# EAGLE design S14FullAmpV2 (EAGLE 9.6.2)
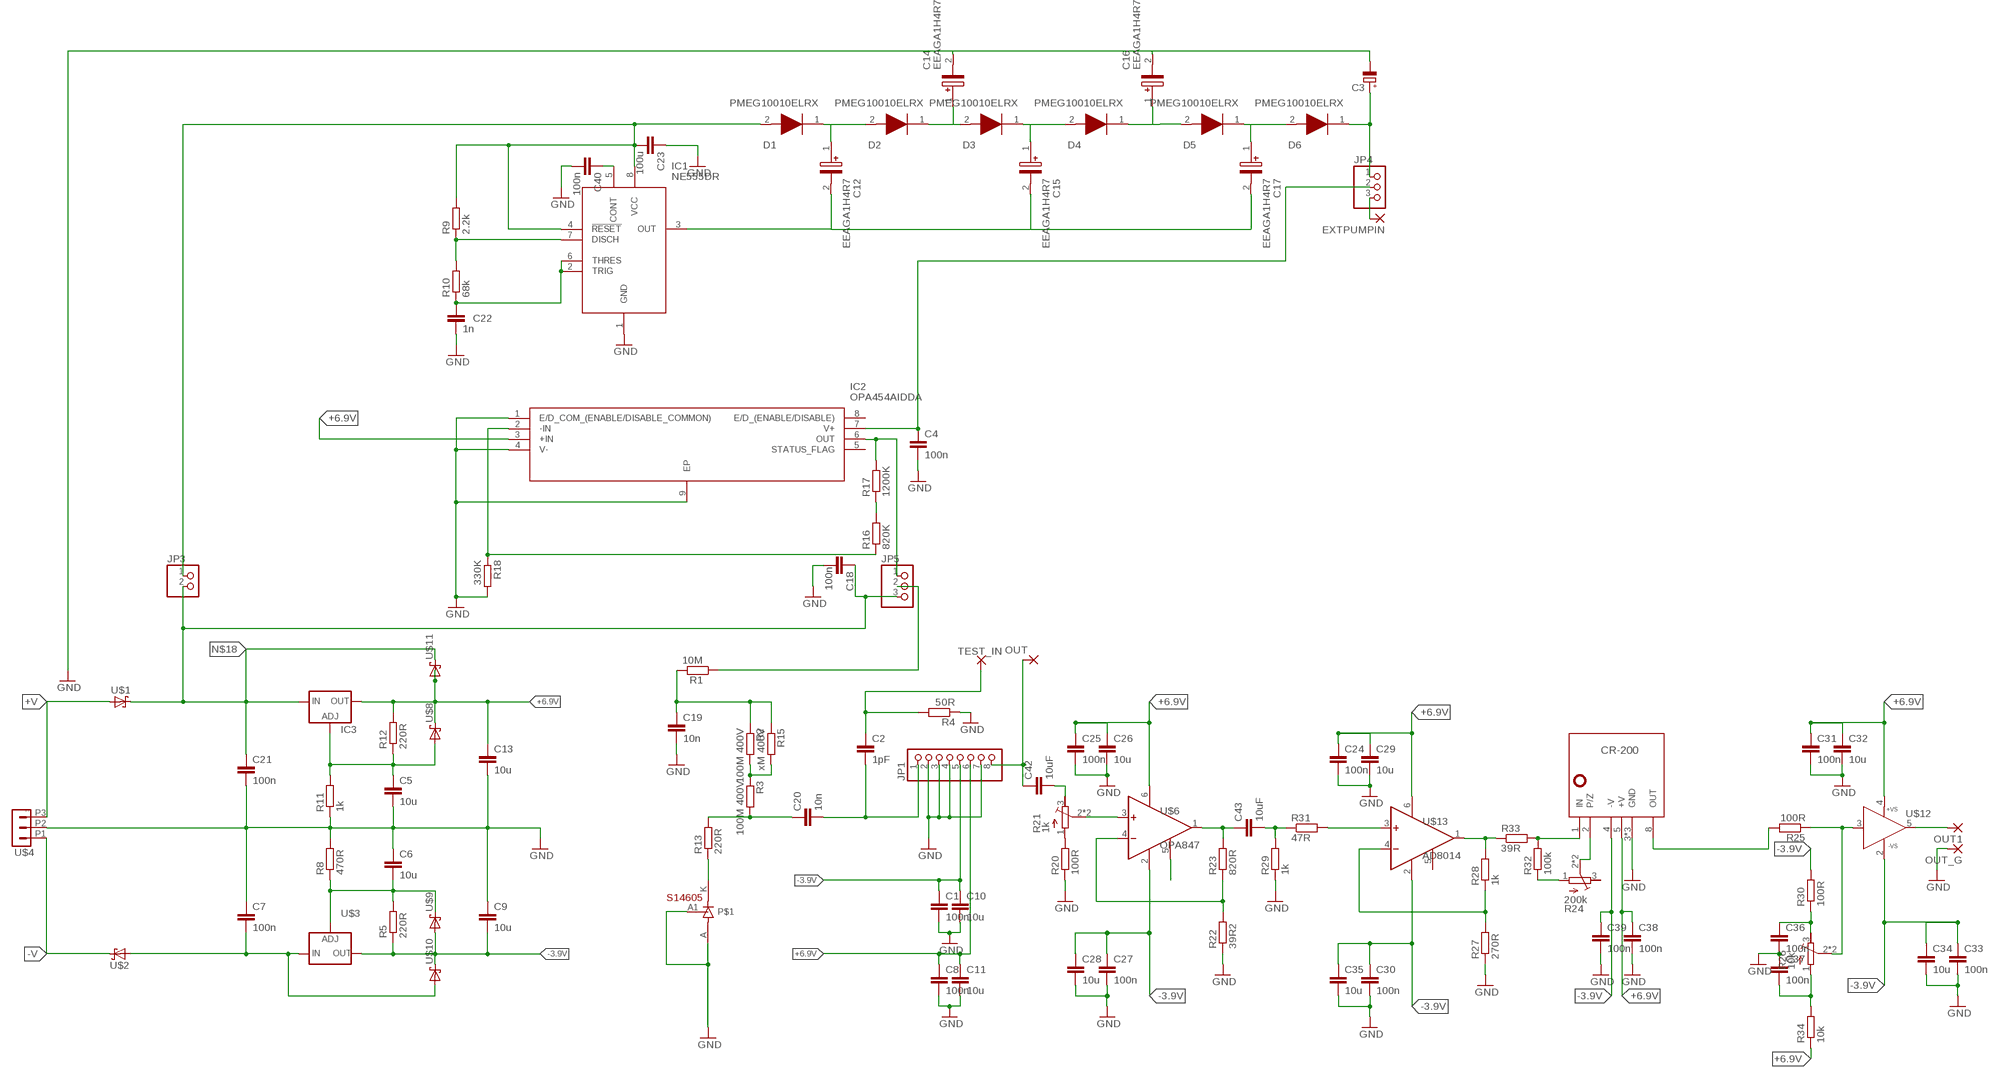
[diagram p0: schematic, sheet 1]

## Parts
C1  100n  C-EUC0603  [C0603]
C2  1pF  C-EUC0603  [C0603]
C3  CPOL-EUE3.5-8  [E3,5-8]
C4  100n  C-EUC0603  [C0603]
C5  10u  C-EUC0805  [C0805]
C6  10u  C-EUC0805  [C0805]
C7  100n  C-EUC0603  [C0603]
C8  100n  C-EUC0603  [C0603]
C9  10u  C-EUC0805  [C0805]
C10  10u  C-EUC0805  [C0805]
C11  10u  C-EUC0805  [C0805]
C12  EEAGA1H4R7  [CAPPRD150W50D400H800]
C13  10u  C-EUC0805  [C0805]
C14  EEAGA1H4R7  [CAPPRD150W50D400H800]
C15  EEAGA1H4R7  [CAPPRD150W50D400H800]
C16  EEAGA1H4R7  [CAPPRD150W50D400H800]
C17  EEAGA1H4R7  [CAPPRD150W50D400H800]
C18  100n  C-EUC0603  [C0603]
C19  10n  C-EUC0603  [C0603]
C20  10n  C-EUC0603  [C0603]
C21  100n  C-EUC0603  [C0603]
C22  1n  C-EUC0603  [C0603]
C23  100u  C-EUC0603  [C0603]
C24  100n  C-EUC0603  [C0603]
C25  100n  C-EUC0603  [C0603]
C26  10u  C-EUC0805  [C0805]
C27  100n  C-EUC0603  [C0603]
C28  10u  C-EUC0805  [C0805]
C29  10u  C-EUC0805  [C0805]
C30  100n  C-EUC0603  [C0603]
C31  100n  C-EUC0603  [C0603]
C32  10u  C-EUC0805  [C0805]
C33  100n  C-EUC0603  [C0603]
C34  10u  C-EUC0805  [C0805]
C35  10u  C-EUC0805  [C0805]
C36  100n  C-EUC0603  [C0603]
C37  100n  C-EUC0603  [C0603]
C38  100n  C-EUC0603  [C0603]
C39  100n  C-EUC0603  [C0603]
C40  100n  C-EUC0603  [C0603]
C42  10uF  C-EUC0805  [C0805]
C43  10uF  C-EUC0805  [C0805]
CR-200  CR-200H  [CR-XXX-H]
D1  PMEG10010ELRX  [SODFL3517X110N]
D2  PMEG10010ELRX  [SODFL3517X110N]
D3  PMEG10010ELRX  [SODFL3517X110N]
D4  PMEG10010ELRX  [SODFL3517X110N]
D5  PMEG10010ELRX  [SODFL3517X110N]
D6  PMEG10010ELRX  [SODFL3517X110N]
EXTPUMPIN  1,6/0,9  [1,6/0,9]
IC1  NE555DR  [SOIC127P600X175-8N]
IC2  OPA454AIDDA  [SOIC127P600X170-9N]
IC3  LM317  [SO-08]
JP1  HEADER-1X8ROUND  [1X08_ROUND]
JP3  PINHD-1X2  [1X02]
JP4  PINHD-1X3  [1X03]
JP5  PINHD-1X3  [1X03]
OUT  1,6/0,9  [1,6/0,9]
OUT1  2,54/0,9  [2,54/0,9]
OUT_G  2,54/0,9  [2,54/0,9]
R1  10M  R-EU_M0805  [M0805]
R2  100M 400V  R-EU_M1206  [M1206]
R3  100M 400V  R-EU_M1206  [M1206]
R4  50R  R-EU_R0805  [R0805]
R5  220R  R-EU_R0603  [R0603]
R8  470R  R-EU_R0603  [R0603]
R9  2.2k  R-EU_R0805  [R0805]
R10  68k  R-EU_R0805  [R0805]
R11  1k  R-EU_R0603  [R0603]
R12  220R  R-EU_R0603  [R0603]
R13  220R  R-EU_R0805  [R0805]
R15  xM 400V  R-EU_M1206  [M1206]
R16  820K  R-EU_R0805  [R0805]
R17  1200K  R-EU_R0805  [R0805]
R18  330K  R-EU_R0805  [R0805]
R20  100R  R-EU_R0603  [R0603]
R21  1k  R-TRIMM3299WS_UNI  [RTRIM3299W]
R22  39R2  R-EU_R0603  [R0603]
R23  820R  R-EU_R0603  [R0603]
R24  200k  R-TRIMM3299WS_UNI  [RTRIM3299W]
R25  100R  R-EU_R0603  [R0603]
R26  10k  R-TRIMM3299WS_UNI  [RTRIM3299W]
R27  270R  R-EU_R0603  [R0603]
R28  1k  R-EU_R0603  [R0603]
R29  1k  R-EU_R0603  [R0603]
R30  100R  R-EU_R0603  [R0603]
R31  47R  R-EU_R0603  [R0603]
R32  100k  R-EU_R0603  [R0603]
R33  39R  R-EU_R0603  [R0603]
R34  10k  R-EU_R0603  [R0603]
S1  S14605  [RHDR3W53P0X254_1X3_762X246X425]
TEST_IN  1,6/0,9  [1,6/0,9]
U$1  BAS383  [MICROMELF-R]
U$2  BAS383  [MICROMELF-R]
U$3  LM337-SO8  [SO8]
U$4  XHT03T  [XHT03]
U$6  OPA847  [SOT23-6]
U$8  BAS383  [MICROMELF-R]
U$9  BAS383  [MICROMELF-R]
U$10  BAS383  [MICROMELF-R]
U$11  BAS383  [MICROMELF-R]
U$12  MAX4201  [SOT23-5]
U$13  AD8014  OPA847  [SOT23-6]

## Nets
+6.9V: C8.1 C11.1 C13.1 C24.1 C25.1 C26.1 C29.1 C31.1 C32.1 C38.1 CR-200.5(+V) IC2.3(+IN) IC3.2(OUT) IC3.3(OUT) IC3.6(OUT) IC3.7(OUT) JP1.6 R12.2 R34.1 U$6.6(V+) U$8.C U$11.A U$12.4(+VS) U$13.6(V+)
+V: U$1.A U$4.P3
-3.9V: C1.1 C9.2 C10.1 C27.1 C28.1 C30.1 C33.1 C34.1 C35.1 C39.1 CR-200.4(-V) JP1.5 R5.1 R30.2 U$3.1(OUT) U$6.2(V-) U$9.A U$10.C U$12.2(-VS) U$13.2(V-)
-V: U$2.C U$4.P1
GND: C1.2 C3.- C4.2 C5.2 C6.1 C7.1 C8.2 C9.1 C10.2 C11.2 C13.2 C14.2(-) C16.2(-) C18.2 C19.2 C21.2 C22.2 C23.1 C24.2 C25.2 C26.2 C27.2 C28.2 C29.2 C30.2 C31.2 C32.2 C33.2 C34.2 C35.2 C36.2 C37.1 C38.2 C39.2 C40.2 CR-200.3(GND) CR-200.6(GND) CR-200.7(GND) IC1.1(GND) IC2.1(E/D_COM_(ENABLE/DISABLE_COMMON)) IC2.4(V-) IC2.9(EP) JP1.2 JP1.3 JP1.4 JP1.7 OUT_G.1(P) R4.1 R8.2 R11.1 R18.2 R20.1 R22.1 R27.1 R29.1 S1.A1 S1.A(ANODE) U$4.P2
N$1: C19.1 R1.2 R2.1 R15.1
N$2: JP5.2 R1.1
N$3: R2.2 R3.1 R15.2
N$4: C20.1 R3.2 R13.2
N$5: C2.2 C20.2 JP1.1
N$6: C2.1 R4.2 TEST_IN.1(P)
N$7: C42.1 JP1.8 OUT.1(P)
N$8: R24.1(A) R32.1
N$9: EXTPUMPIN.1(P) JP4.3
N$10: C23.2 D1.2(A) IC1.4(!RESET) IC1.8(VCC) JP3.1 R9.2
N$12: C6.2 R5.2 R8.1 U$3.4(ADJ) U$9.C
N$13: R13.1 S1.K(KATHODE)
N$14: C5.1 IC3.4(ADJ) R11.2 R12.1 U$8.A
N$15: R16.2 R17.1
N$16: C12.1(+) D1.1(K) D2.2(A)
N$17: C12.2(-) C15.2(-) C17.2(-) IC1.3(OUT)
N$18: C18.1 C21.1 IC3.1(IN) JP3.2 JP5.3 U$1.C U$11.C
N$19: C14.1(+) D2.1(K) D3.2(A)
N$20: C40.1 IC1.5(CONT)
N$21: C3.+ D6.1(K) JP4.1
N$22: C15.1(+) D3.1(K) D4.2(A)
N$23: C16.1(+) D4.1(K) D5.2(A)
N$24: R20.2 R21.1(A)
N$25: C17.1(+) D5.1(K) D6.2(A)
N$26: C42.2 R21.3(E)
N$27: IC1.7(DISCH) R9.1 R10.2
N$28: C22.1 IC1.2(TRIG) IC1.6(THRES) R10.1
N$29: IC2.6(OUT) JP5.1 R17.2
N$30: IC2.2(-IN) R16.1 R18.1
N$31: R22.2 R23.1 U$6.4(-IN)
N$32: R21.2(S) R21.4(S) U$6.3(+IN)
N$35: R25.1 R26.2(S) R26.4(S) U$12.3(IN)
N$36: OUT1.1(P) U$12.5(OUT)
N$37: R27.2 R28.1 U$13.4(-IN)
N$38: CR-200.1(IN) R32.2 R33.2
N$39: R31.2 U$13.3(+IN)
N$40: U$6.5(SH)
N$41: C36.1 R26.3(E) R30.1
N$42: CR-200.2(P/Z) R24.2(S) R24.4(S)
N$43: C43.1 R23.2 U$6.1(OUT)
N$44: C43.2 R29.2 R31.1
N$45: C4.1 IC2.7(V+) JP4.2
N$46: R28.2 R33.1 U$13.1(OUT)
N$47: C37.2 R26.1(A) R34.2
N$48: CR-200.8(OUT) R25.2
V-: C7.2 U$2.A U$3.2(IN) U$3.3(IN) U$3.6(IN) U$3.7(IN) U$10.A
Unconnected: IC2.5(STATUS_FLAG) IC2.8(E/D_(ENABLE/DISABLE)) R24.3(E)

## Power pins joined to a net without a drawn wire
SH: U$13.5(SH)

## Library data of the parts
C1 C4 C8 C10 C11 C19 C20 C22 C26 C28 C29 C32 C34 C35 C42 C43 = resistor:C-EU: CAPACITOR, European symbol
C2 C5-C7 C9 C13 C18 C21 C23-C25 C27 C30 C31 C33 C36-C40 = rcl:C-EU: CAPACITOR, European symbol
C3 = rcl:CPOL-EU: POLARIZED CAPACITOR, European symbol
C12 C14-C17 = EEAGA1H4R7:EEAGA1H4R7: Panasonic 4.7F 50V dc Aluminium Electrolytic Capacitor, Through Hole 4 (Dia.) x 7mm +105C 4mm 1.5mm Source: Datasheet <http://industrial.panasonic.com/cdbs/www-data/pdf/RDF0000/ABA0000C1041.pdf>; DESCRIPTION: Panasonic 4.7F 50V dc Aluminium Electrolytic Capacitor, Through Hole 4 (Dia.) x 7mm +105C 4mm 1.5mm; HEIGHT: 8mm; MANUFACTURER_NAME: Panasonic; MANUFACTURER_PART_NUMBER: EEAGA1H4R7
CR-200 = cremat:CR-200
D1-D6 = PMEG10010ELRX:PMEG10010ELRX: Diode Schottky 100V 1A Surface Mount CFP3 Source: Datasheet <https://assets.nexperia.com/documents/data-sheet/PMEG10010ELR.pdf>; DESCRIPTION: Diode Schottky 100V 1A Surface Mount CFP3; HEIGHT: 1.1mm; MANUFACTURER_NAME: Nexperia; MANUFACTURER_PART_NUMBER: PMEG10010ELRX; MOUSER_PART_NUMBER: 771-PMEG10010ELRX; MOUSER_PRICE-STOCK: https://www.mouser.co.uk/ProductDetail/Nexperia/PMEG10010ELRX?qs=bel5lzaZNxTBP7lsf64PhA%3D%3D
EXTPUMPIN OUT TEST_IN = wirepad:1,6/0,9: THROUGH-HOLE PAD
IC1 = NE555DR:NE555DR: Single Precision Timer Source: Datasheet <https://www.ti.com/lit/gpn/ne555>; DESCRIPTION: Single Precision Timer; HEIGHT: 1.75mm; MANUFACTURER_NAME: Texas Instruments; MANUFACTURER_PART_NUMBER: NE555DR
IC2 = OPA454AIDDA:OPA454AIDDA: High Voltage (100V), High-Current (50mA) Operational Amplifiers, G=1 Stable Source: Datasheet <http://componentsearchengine.com/Datasheets/3/OPA454AIDDA.pdf>; DESCRIPTION: High Voltage (100V), High-Current (50mA) Operational Amplifiers, G=1 Stable; HEIGHT: 1.7mm; MANUFACTURER_NAME: Texas Instruments; MANUFACTURER_PART_NUMBER: OPA454AIDDA
IC3 = v-reg:LM317?*: 500 mA Adjustable Output Positive Voltage Regulator Source: http://www.onsemi.co.jp .. LM317M-D.PDF
JP1 = microbuilder:HEADER-1X8: PIN HEADER
JP3 = pinhead:PINHD-1X2: PIN HEADER
JP4 JP5 = pinhead:PINHD-1X3: PIN HEADER
OUT1 OUT_G = wirepad:2,54/0,9: THROUGH-HOLE PAD
R1 R4 R5 R8-R13 R16-R18 R20 R22 R23 R25 R27-R34 = rcl:R-EU_: RESISTOR, European symbol
R2 R3 R15 = resistor:R-EU_: RESISTOR, European symbol
R21 R24 R26 = rcl:R-TRIMM: Trimm resistor
S1 = S14:S14605
U$1 U$2 U$8-U$11 = diode:BAS383
U$3 = v-reg:LM337-SO8
U$4 = Connectors:XHT03
U$6 U$13 = texas:OPA847
U$12 = analog-devices:MAX4201

## Board
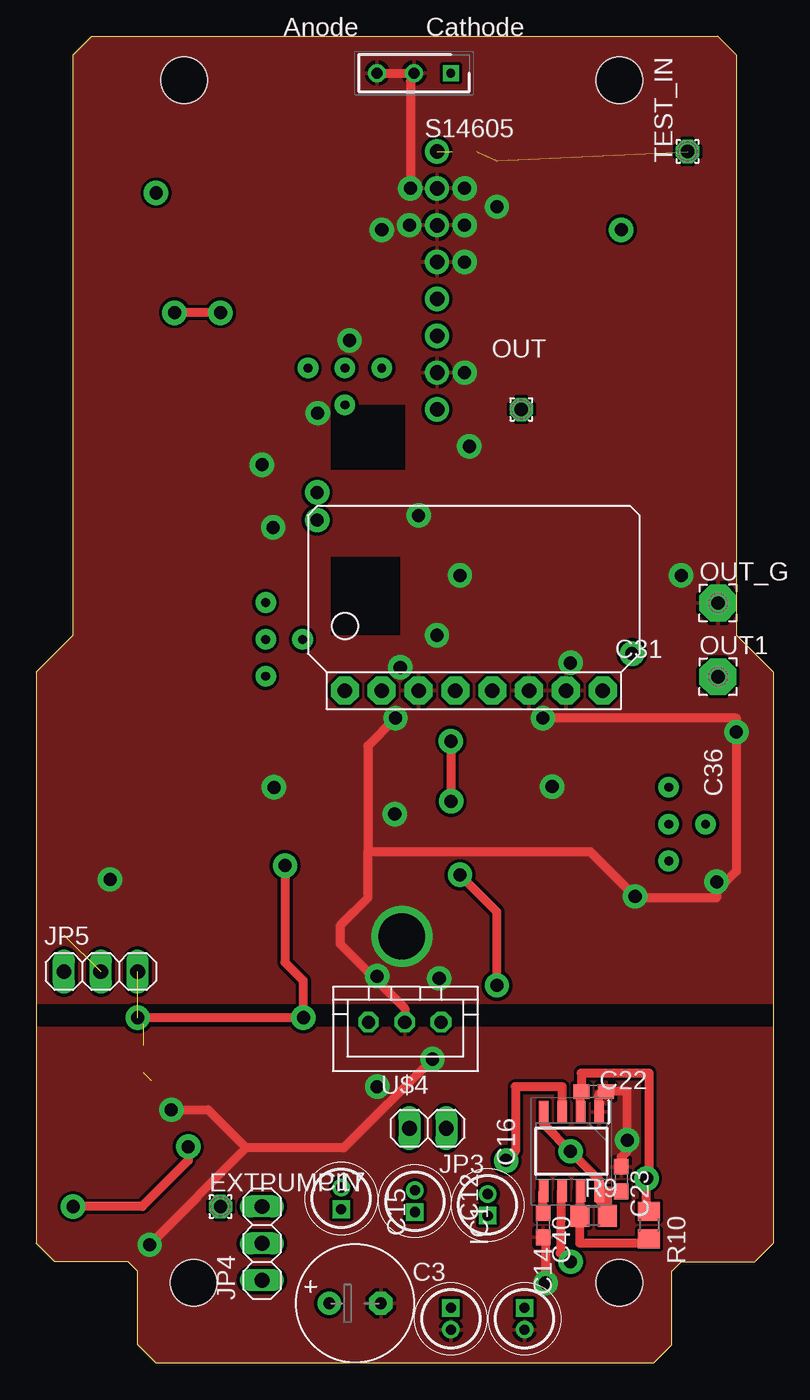
[diagram p1: board, top side]
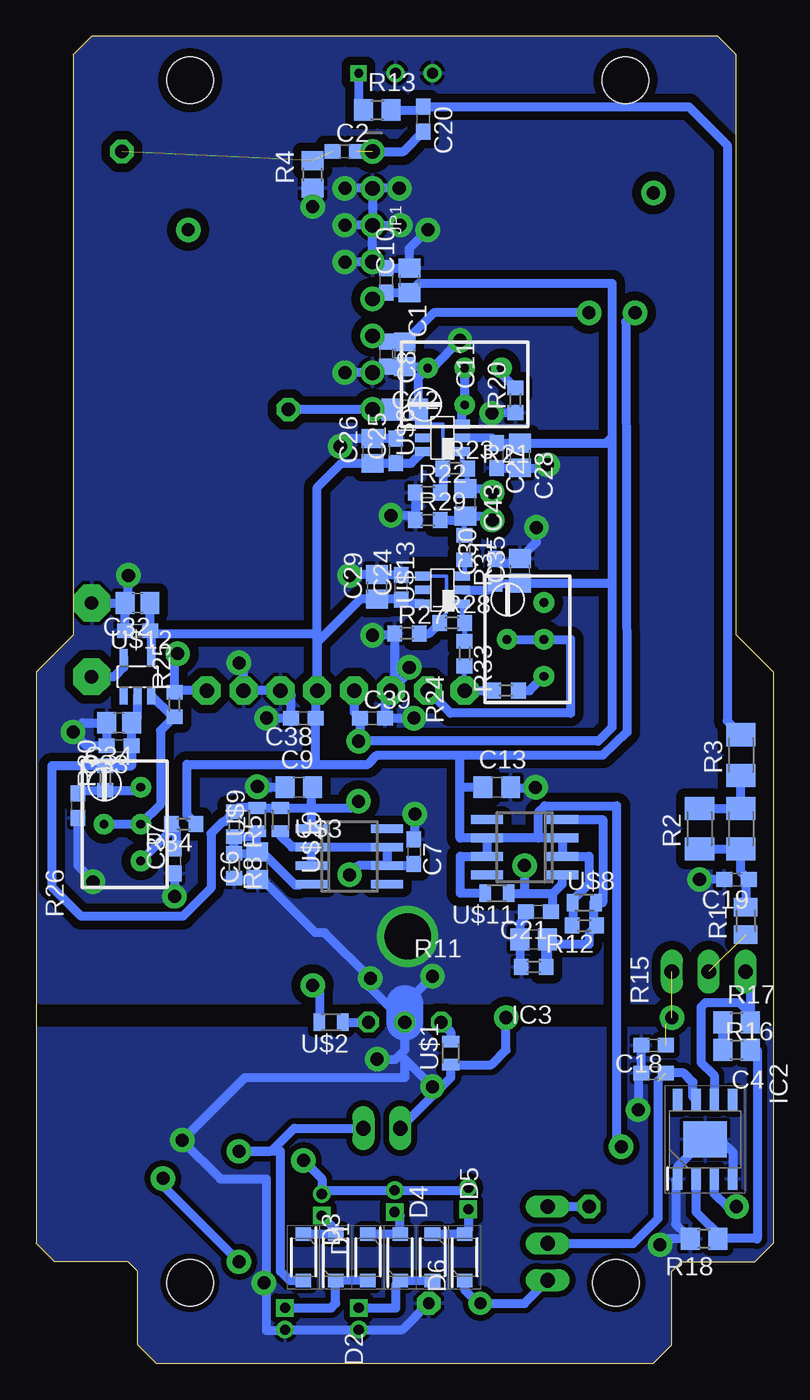
[diagram p2: board, bottom side, seen from below]

Size 50.8 x 91.44 mm. Coordinates in mm from the lower left corner, seen from the top.
Outline: 50.8,20.96 arc0 50.8,20.96
Outline: 3.81,91.44 46.99,91.44 48.26,90.17 48.26,50.16 50.8,47.62 50.8,8.25 49.53,6.98 44.45,6.98 43.81,6.35 43.81,1.27 42.55,0 8.26,0 6.99,1.27 6.99,6.35 6.35,6.98 1.27,6.98 0,8.25 0,47.62 2.54,50.16 2.54,90.17 3.81,91.44
Copper layers (1*16): Top 0.035mm / dielectric 1.5mm / Bottom 0.035mm
Design rules "default *": minimum track width 6mil, minimum drill 0.35mm, track to track 9mil, track to pad 9mil, pad to pad 9mil, via to via 9mil, smd to smd 6mil, copper to edge 0mil, drill to drill 6mil, minimum pad ring 10mil, minimum via ring 8mil, stop-mask expansion 4mil, vias tented up to drill 0mil, thermal gap 10mil
Holes 3.2 mm at 40.2,88.41 40.2,5.54 10.21,88.41 10.84,5.54

### Footprints (pad centres in the part's own frame; a part is rotated, then mirrored left to right if it is on the bottom)
C0603 = smd 1.1 x 1: 1 -0.85,0; 2 0.85,0
E3,5-8 = drill 0.813 pad 1.6: + -1.778,0 | drill 0.813 pad 1.6 octagon: - 1.778,0
C0805 = smd 1.3 x 1.5: 1 -0.95,0; 2 0.95,0
C0805' = smd 1.3 x 1.5: 1 -0.85,0; 2 0.85,0
CAPPRD150W50D400H800 = drill 0.7 pad 1.1 square: 1 0,0 | drill 0.7 pad 1.1: 2 1.5,0
CR-XXX-H = drill 1 pad 1.93 octagon: 1 -8.89,0; 2 -6.35,0; 3 -3.81,0; 4 -1.27,0; 5 1.27,0; 6 3.81,0; 7 6.35,0; 8 8.89,0
SODFL3517X110N = smd 0.92 x 1.08: 1 -1.6,0; 2 1.6,0
1,6/0,9 = drill 0.914 pad 1.6 octagon: 1 0,0
SOIC127P600X175-8N = smd 1.528 x 0.65: 1 -2.711,1.905; 2 -2.711,0.635; 3 -2.711,-0.635; 4 -2.711,-1.905; 5 2.711,-1.905; 6 2.711,-0.635; 7 2.711,0.635; 8 2.711,1.905
SOIC127P600X170-9N = smd 1.525 x 0.65: 1 -2.712,1.905; 2 -2.712,0.635; 3 -2.712,-0.635; 4 -2.712,-1.905; 5 2.712,-1.905; 6 2.712,-0.635; 7 2.712,0.635; 8 2.712,1.905 | smd 2.49 x 3: 9 0,0
SO-08 = smd 0.6 x 2.2: 1 -1.905,-2.6; 2 -0.635,-2.6; 3 0.635,-2.6; 4 1.905,-2.6; 5 1.905,2.6; 6 0.635,2.6; 7 -0.635,2.6; 8 -1.905,2.6
1X08_ROUND = drill 1 pad 1.676: 1 -8.89,0; 2 -6.35,0; 3 -3.81,0; 4 -1.27,0; 5 1.27,0; 6 3.81,0; 7 6.35,0; 8 8.89,0
1X02 = drill 1.016 long: 1 -1.27,0; 2 1.27,0
1X03 = drill 1.016 long: 1 -2.54,0; 2 0,0; 3 2.54,0
2,54/0,9 = drill 0.914 pad 2.54 octagon: 1 0,0
M0805 = smd 1.3 x 1.6: 1 -0.95,0; 2 0.95,0
M1206 = smd 1.6 x 2: 1 -1.4,0; 2 1.4,0
R0805 = smd 1.3 x 1.5: 1 -0.95,0; 2 0.95,0
R0603 = smd 1 x 1.1: 1 -0.85,0; 2 0.85,0
RTRIM3299W = drill 0.61 pad 1.422: 1 1.27,-2.54; 2 1.27,0; 3 1.27,2.54; 4 -1.27,0
RHDR3W53P0X254_1X3_762X246X425 = drill 0.75 pad 1.15: A 8.89,3.81; A1 6.35,3.81 | drill 0.6 square: K 3.81,3.81
MICROMELF-R = smd 0.8 x 1.2: A 0.8,0; C -0.8,0
SO8 = smd 0.6 x 2.2: 1 -1.905,-2.6; 2 -0.635,-2.6; 3 0.635,-2.6; 4 1.905,-2.6; 5 1.905,2.6; 6 0.635,2.6; 7 -0.635,2.6; 8 -1.905,2.6
XHT03 = drill 0.9 pad 1.422 octagon: P1 -2.5,0 | drill 0.9 octagon: P2 0,0; P3 2.5,0
SOT23-6 = smd 0.6 x 1.1: 1 -1,-1.4; 2 -0.05,-1.4; 3 0.9,-1.4; 4 0.9,1.3; 5 -0.05,1.3; 6 -1,1.3
SOT23-5 = smd 0.55 x 1.2: 1 -0.95,-1.3; 2 0,-1.3; 3 0.95,-1.3; 4 0.95,1.3; 5 -0.95,1.3

### Placement (x,y rotation side)
C1  26.67,74.61 90 bottom
C2  29.53,83.5 0 bottom
C3  21.97,4.13 0 top
C4  8.26,20 180 bottom
C5  16.51,29.21 180 bottom
C6  35.56,34.29 90 bottom
C7  24.77,35.24 270 bottom
C8  26.67,69.53 270 bottom
C9  32.7,39.69 0 bottom
C10  10u  [C0805']  25.08,74.61 90 bottom
C11  10u  [C0805']  25.4,69.53 270 bottom
C12  31.11,10.16 90 top
C13  19.05,39.69 0 bottom
C14  33.66,3.81 270 top
C15  26.1,10.41 90 top
C16  28.57,3.81 270 top
C17  21.02,10.6 90 top
C18  8.26,21.91 180 bottom
C19  2.54,33.34 180 bottom
C20  24.13,85.72 270 bottom
C21  16.19,31.11 180 bottom
C22  38.42,18.73 0 top
C23  40.32,12.7 270 top
C24  25.65,53.47 90 bottom
C25  26.03,62.86 90 bottom
C26  10u  [C0805']  27.62,62.86 90 bottom
C27  19.05,62.55 270 bottom
C28  10u  [C0805']  17.46,62.55 270 bottom
C29  10u  [C0805']  27.3,53.5 90 bottom
C30  19.18,54.58 90 bottom
C31  43.81,50.48 180 bottom
C32  10u  [C0805']  43.81,52.39 180 bottom
C33  45.09,42.55 180 bottom
C34  10u  [C0805']  45.09,44.13 180 bottom
C35  10u  [C0805']  17.46,54.61 90 bottom
C36  47.94,38.42 270 bottom
C37  41.27,34.61 90 bottom
C38  32.38,44.45 180 bottom
C39  27.62,44.45 0 bottom
C40  34.92,9.52 270 top
C42  25.4,65.72 0 bottom
C43  21.22,59.32 270 bottom
CR-200  30.16,46.35 0 top
D1  32.38,7.3 270 bottom
D2  30.16,7.3 90 bottom
D3  27.94,7.3 270 bottom
D4  25.72,7.3 90 bottom
D5  23.49,7.3 270 bottom
D6  21.27,7.3 90 bottom
EXTPUMPIN  12.7,10.79 0 top
IC1  36.88,14.61 270 top
IC2  4.7,15.43 90 bottom
IC3  17.15,35.56 90 bottom
JP1  27.62,74.61 270 bottom
JP3  26.99,16.19 180 top
JP4  15.56,8.25 90 top
JP5  4.45,26.99 0 top
OUT  33.43,65.72 0 top
OUT1  46.99,47.31 0 top
OUT_G  46.99,52.39 0 top
R1  1.9,30.48 90 bottom
R2  5.08,36.83 90 bottom
R3  2.22,41.91 90 bottom
R4  31.75,81.91 90 bottom
R5  37.15,37.15 270 bottom
R8  37.15,34.29 270 bottom
R9  38.42,10.16 0 top
R10  42.23,9.52 270 top
R11  16.51,27.31 0 bottom
R12  13.02,30.16 180 bottom
R13  27.3,86.36 0 bottom
R15  2.22,36.83 90 bottom
R16  2.54,21.59 180 bottom
R17  2.54,23.5 0 bottom
R18  4.76,8.57 180 bottom
R20  17.78,66.36 90 bottom
R21  21.27,67.31 90 bottom
R22  23.81,60.01 0 bottom
R23  21.92,61.66 0 bottom
R24  17.08,49.88 0 bottom
R25  41.27,45.4 90 bottom
R26  44.86,37.15 0 bottom
R27  25.24,50.29 0 bottom
R28  22.13,51.02 0 bottom
R29  23.81,58.1 0 bottom
R30  46.04,40.32 90 bottom
R31  21.27,56.2 270 bottom
R32  18.41,46.35 180 bottom
R33  21.27,48.89 270 bottom
R34  40.64,37.15 180 bottom
S1  32.38,92.71 180 top
TEST_IN  44.89,83.5 90 top
U$1  22.23,21.37 90 bottom
U$2  30.48,23.5 180 bottom
U$3  29.21,34.92 270 bottom
U$4  25.4,23.5 180 top
U$6  22.86,63.82 90 bottom
U$8  13.02,31.75 0 bottom
U$9  35.56,37.47 90 bottom
U$10  33.97,37.47 270 bottom
U$11  19.05,32.39 180 bottom
U$12  43.81,47.31 0 bottom
U$13  22.86,53.34 90 bottom

### Tracks (layer width: path | path; a pad name or v marks a point on that pad's centre or on a via)
+6.9V  (via drill 0.9 pad 1.68)
  Top 0.61: v10.48,14.92 10.48,13.97 7.3,10.79 v2.54,10.79 | v12.7,72.39 v9.53,72.39
  Bottom 0.61: IC3.6 IC3.7 21.59,34.92 21.59,32.39 U$11.A | 16.19,36.19 IC3.3 IC3.2 12.7,34.92 12.7,33.03 13.82,31.91 U$8.C 13.82,30.21 R12.2 | 16.19,36.19 IC3.6 | IC3.6 21.59,36.19 21.59,39.69 | C31.1 42.86,50.38 U$12.4 | C31.1 C32.1 | R34.1 40.42,37.78 40.42,41.28 31.53,41.28 | 21.59,39.69 21.59,41.91 | CR-200.5 31.53,46.25 C38.1 31.53,41.28 | U$6.6 24.96,62.02 C25.1 C26.1 29.74,62.02 31.43,60.33 31.43,49.66 | 16.19,36.19 16.18,36.21 16.18,37.99 15.75,38.42 10.79,38.42 10.79,15.24 v10.48,14.92 | v2.54,10.79 3.18,10.79 4.06,11.68 IC2.3 | U$13.6 25.38,52.34 C24.1 25.69,52.65 C29.1 28.44,52.65 31.43,49.66 | CR-200.5 31.43,49.66 | C31.1 42.75,50.27 31.64,50.27 31.43,50.06 CR-200.5 | v9.53,72.39 10.16,71.75 10.08,43.5 11.75,41.91 21.59,41.91 | 31.53,41.28 27.94,41.28 27.3,41.91 21.59,41.91 | C13.1 21.59,39.69 | JP1.6 27.2,70.38 C8.1 C11.1 23.39,72.39 v12.7,72.39
+V
  Bottom 0.61: U$4.P3 22.23,22.82 U$1.A
-3.9V  (via drill 0.9 pad 1.68)
  Top 0.61: v28.57,42.86 28.59,42.84 v28.59,38.72
  Bottom 0.61: 32.07,38.27 U$10.C U$9.A 35.61,38.31 36.83,38.31 R5.1 37.81,37.33 37.92,37.33 38.76,36.49 38.76,32.75 40.71,30.8 47.69,30.8 49.72,32.83 49.72,41.17 R30.2 44.23,41.17 C33.1 C34.1 43.81,44.55 U$12.2 | 32.07,38.27 31.81,38.01 | U$3.1 31.81,38.01 | 32.07,38.27 29.05,38.27 v28.59,38.72 | CR-200.4 28.89,44.87 C39.1 28.47,42.86 v28.57,42.86 12.06,42.86 11.11,43.81 11.11,53.97 | 11.11,63.82 11.11,74.42 24.42,74.42 C10.1 C1.1 27.09,73.34 JP1.5 | 11.11,63.82 11.11,53.97 | U$6.2 19.42,63.77 C27.1 C28.1 11.53,63.4 11.11,63.82 | U$13.2 19.62,53.29 C30.1 17.49,53.73 C35.1 11.33,53.76 11.11,53.97 | 31.81,38.01 31.81,39.63 C9.2
-V
  Bottom 0.61: U$2.C U$4.P1
GND  (via drill 0.9 pad 1.68, 3.2)
  Top 0.61: C23.1 40.32,14.19 40.73,14.61 v40.73,15.37 40.73,18.73 C22.2 | S1.A S1.A1 26.03,88.58 25.78,88.33 v25.78,80.96 | v27.3,20.96 21.18,14.83 14.48,14.83 | 14.48,14.83 v7.81,8.16 8.1,8.45 | v34.92,44.45 48.26,44.45 v48.26,43.5 48.26,33.91 47.37,33.02 47.05,33.02 v46.89,33.18 46.89,32.07 41.38,32.07 v41.27,32.17 38.2,35.24 22.86,35.24 | U$4.P2 25.4,24.45 20.95,28.89 20.95,30.16 22.86,32.07 22.86,35.24 | v24.77,44.45 22.86,42.55 22.86,35.24 | IC1.1 38.79,18.55 | C40.2 35.11,8.49 v35.11,5.53 | v9.31,17.46 11.84,17.46 14.48,14.83
  Bottom 0.61: 34.92,5.71 34.92,2.25 33.71,2.25 | 34.92,5.71 34.92,12.7 38.1,12.7 40.73,15.33 v40.73,15.37 36.42,19.68 25.4,19.68 25.4,20.96 v23.49,19.05 | R11.1 17.46,27.31 C5.2 17.46,30.32 17.04,30.8 C21.2 | 32.07,79.38 v31.75,79.69 | 25.4,24.76 v23.49,26.67 | v27.3,20.96 26.03,20.96 25.4,21.59 U$4.P2 28.1,26.19 v27.77,26.52 30.92,29.66 31.56,29.66 35.24,33.34 C6.1 37.05,33.34 R8.2 | OUT_G.1 C32.2 | C31.2 C32.2 | C32.2 44.45,52.6 v44.45,54.29 | CR-200.3 26.77,45.94 C39.2 v24.77,44.45 | v34.92,44.45 C38.2 33.23,46.04 33.55,46.35 CR-200.6 CR-200.7 36.51,47.94 v36.83,48.26 | v46.89,33.18 46.89,33.24 47.94,34.29 C36.2 | C37.1 v41.27,32.17 | v7.81,8.16 7.81,8.38 7.62,8.57 R18.2 6.73,9.59 6.73,12.59 IC2.1 6.6,13.53 IC2.9 3.68,15.43 2.76,14.51 2.76,12.75 IC2.4 | v35.11,5.53 34.92,5.71 | JP1.2 JP1.3 | JP1.4 JP1.3 | v25.78,80.96 JP1.2 | v19.4,65.47 19.36,65.51 R20.1 | v9.31,17.46 9.31,19.8 C4.2 C18.2 | v23.81,78.1 25.08,76.83 C10.2 C1.2 27.09,75.88 JP1.4 | v21.59,70.48 23.39,68.68 C11.2 C8.2 27.2,68.68 JP1.7 v29.53,68.26 | C27.2 C28.2 15.77,61.7 v15.56,61.91 | R22.1 R29.1 24.98,58.42 v26.35,58.42 | C24.2 27.27,54.32 C29.2 29.15,54.35 v29.21,54.29 | C30.2 18.88,55.13 17.79,55.13 C35.2 | C35.2 16.32,56.6 v16.32,57.6 | C25.2 C26.2 29.31,63.72 v29.84,63.18 | CR-200.3 26.09,46.62 R27.1 26.22,50.16 v27.62,50.16 | JP1.3 v29.53,78.42 | C19.2 v5.08,33.34 | JP1.4 v29.53,75.88 | JP1.2 v29.53,80.96 | CR-200.3 25.09,47.62 v25.09,47.95 | C7.1 24.71,36.15 v24.71,37.84 | C13.2 18.07,39.66 16.41,39.66 v16.38,39.69 | C9.1 35.52,39.69 v35.56,39.73 | JP1.3 v25.72,78.42 | C3.- 25.57,2.31 C16.2 C14.2 | C34.2 C33.2 47.31,42.55 v48.26,43.5 47.62,44.13 C34.2
  Bottom 2.54: U$4.P2 25.4,24.76
  other vias: 25.2,29.41
  pour Bottom (isolate 0.406): 0,23.18 50.8,23.18 50.8,8.25 49.53,6.98 44.45,6.98 43.81,6.35 43.81,1.27 42.55,0 8.26,0 6.99,1.27 6.99,6.35 6.35,6.98 1.27,6.98 0,8.25
  pour Top: 50.8,23.18 50.8,8.25 49.53,6.98 44.45,6.98 43.81,6.35 43.81,1.27 42.55,0 8.26,0 6.99,1.27 6.99,6.35 6.35,6.98 1.27,6.98 0,8.25 0,23.18
  cutout Top: 25.4,66.04 25.4,61.59 20.32,61.59 20.32,66.04
  cutout Bottom: 20.32,61.59 20.32,66.04 25.4,66.04 25.4,61.59
  cutout Bottom: 20,55.56 25.08,55.56 25.08,50.8 20,50.8
  cutout Top: 20.32,55.56 25.08,55.56 25.08,50.16 20.32,50.16
  pour Bottom (isolate 0.61): 50.8,24.76 0,24.76 0,47.62 2.54,50.16 2.54,90.17 3.81,91.44 46.99,91.44 48.26,90.17 48.26,50.16 50.8,47.62
  pour Top: 50.8,24.76 50.8,47.62 48.26,50.16 48.26,90.17 46.99,91.44 3.81,91.44 2.54,90.17 2.54,50.16 0,47.62 0,24.76
N$1
  Bottom 0.61: R2.1 R15.1 2.22,33.87 C19.1 1.9,33.12 R1.2
N$2  (1 unrouted)
N$3
  Bottom 0.61: R2.2 R15.2 R3.1
N$4
  Bottom 0.61: R13.2 24.34,86.36 C20.1 5.81,86.58 3.18,83.94 3.18,44.26 R3.2
N$5  (1 unrouted)
  Bottom 0.61: JP1.1 25.5,83.5 C20.2
N$6  (2 unrouted)
N$7
  Bottom 0.61: OUT.1 JP1.8 C42.1 26.04,65.72
N$8
  Bottom 0.61: R32.1 16.8,46.35 R24.1
N$9
  Bottom 0.61: JP4.3 EXTPUMPIN.1
N$10  (via drill 0.9 pad 1.68)
  Top 0.61: C23.2 39.37,11.85 R9.2 39.45,10.16 39.45,10.59 38.79,11.26 IC1.8 38.79,12.65 v36.83,14.61 34.98,16.46 IC1.4
  Bottom 0.61: D1.2 33.34,5.7 33.97,6.33 33.97,14.6 v36.83,14.6 v36.83,14.61 34.61,14.61 33.02,16.19 JP3.1
N$12
  Bottom 0.61: U$3.4 32.77,33.02 32.68,32.94 32.94,32.94 35.24,35.24 C6.2 35.66,35.14 | 35.66,35.14 R8.1 R5.2 35.93,36.3 U$9.C 35.66,36.56 35.66,35.14
N$13
  Bottom 0.61: S1.K 28.57,86.68 R13.1
N$14
  Bottom 0.61: IC3.4 11.75,37.47 11.75,31.75 U$8.A 12.38,31.75 12.38,30.16 R12.1 12.7,29.63 12.7,28.89 15.66,28.89 R11.2 15.56,27.4 C5.1
N$15
  Bottom 0.61: R16.2 R17.1
N$16
  Bottom 0.61: D1.1 D2.2 30.16,9.21 C12.1
N$17  (via drill 0.9 pad 1.68)
  Top 0.61: IC1.3 36.25,19.05 33.02,19.05 33.02,14.61 v32.38,13.97
  Bottom 0.61: C17.2 21.21,11.91 C15.2 30.86,11.91 C12.2 31.11,12.7 v32.38,13.97
N$18  (via drill 0.9 pad 1.68)  (2 unrouted)
  Top 0.61: v17.15,34.29 17.15,27.62 18.41,26.35 v18.41,23.81 v6.99,23.81
  Bottom 0.61: v18.41,23.81 18.41,21.59 19.44,20.57 U$1.C 22.23,19.68 JP3.2 | v17.15,34.29 17.15,32.39 | 7.4,23.39 v6.99,23.81 | IC3.1 14.54,33.02 15.18,32.39 | C21.1 15.18,31.28 15.18,32.39 | U$11.C 17.15,32.39 | 17.15,32.39 15.18,32.39
N$19
  Bottom 0.61: C14.1 30.48,3.81 30.16,4.13 D2.1 D3.2
N$20
  Top 0.61: C40.1 34.92,11.84 IC1.5
N$21
  Bottom 0.61: D6.1 21.27,5.07 20.33,4.13 C3.+ 17.15,4.13 JP4.1
N$22
  Bottom 0.61: D3.1 D4.2 25.72,10.17 25.96,10.41 C15.1
N$23
  Bottom 0.61: C16.1 26.03,3.81 26.03,5.39 D4.1 D5.2
N$24
  Bottom 0.61: R21.1 18.73,68.16 R20.2
N$25
  Bottom 0.61: D5.1 D6.2 21.02,9.16 C17.1
N$26
  Bottom 0.61: C42.2 24.45,67.94 R21.3
N$27
  Top 0.61: IC1.7 37.48,11.86 R9.1 | R9.1 37.46,10.13 37.46,8.29 37.48,8.27 41.92,8.27 R10.2 | R9.1
N$28  (via drill 0.9 pad 1.68)
  Top 0.61: IC1.6 36.18,11.82 36.13,7.61 36.21,7.61 v36.83,6.98 | IC1.2 37.52,18.68 C22.1 37.57,20 42.23,20 42.23,12.89 v42.07,12.73 42.07,10.63 R10.1
  Bottom 0.61: v42.07,12.73 42.07,12.22 v36.83,6.98
N$29
  Bottom 0.61: IC2.6 4.06,19.82 4.99,20.75 4.99,24.53 4.68,24.84 2.3,24.84 1.59,24.13 R17.2 1.59,26.67 JP5.1
N$30
  Bottom 0.61: 1.1,8.6 1.1,21.59 R16.1 | R18.1 3.81,8.6 3.49,8.6 | 1.13,8.57 1.1,8.6 | 1.1,8.6 3.49,8.6 | 3.49,8.6 5.33,10.44 IC2.2
N$31
  Bottom 0.254: U$6.4 22.76,64.72 22.76,61.67 R23.1
  Bottom 0.61: R23.1 22.77,60.01 R22.2
N$32
  Bottom 0.61: R21.2 R21.4 21.46,65.85 U$6.3
N$33  (via drill 0.9 pad 1.68)
  other vias: 40.32,78.1
N$34  (via drill 0.9 pad 1.68)
  other vias: 8.26,80.64
N$35
  Bottom 0.61: U$12.3 41.41,44.55 R25.1 42.23,43.6 42.23,38.51 R26.2 R26.4
N$36
  Bottom 0.61: OUT1.1 46.96,47.34 45.4,47.34 44.77,47.97 U$12.5
N$37
  Bottom 0.254: U$13.4 22.54,54.24 22.54,51.73 22.98,51.29 R28.1
  Bottom 0.61: R27.2 23.71,50.29 R28.1
N$38
  Bottom 0.356: CR-200.1 R33.2
  Bottom 0.61: CR-200.1 R32.2
N$39
  Bottom 0.356: R31.2 21.27,54.43 U$13.3
N$41
  Bottom 0.61: C36.1 47.94,39.47 R30.1 43.81,39.47 R26.3
N$42
  Bottom 0.61: CR-200.2 22.26,44.8 13.97,44.8 13.97,49.88 R24.2 R24.4
N$43  (via drill 0.9 pad 1.68)
  Bottom 0.356: C43.1 21.07,60.42 R23.2 21.46,62.05 U$6.1
  Bottom 0.61: v19.37,60.01 19.63,60.27 C43.1
N$44  (via drill 0.9 pad 1.68)
  Bottom 0.356: 21.22,57.1 R31.1 21.27,58.32 C43.2
  Bottom 0.61: v19.37,58.1 19.64,58.37 C43.2 21.49,58.1 R29.2
N$45  (1 unrouted)
  Bottom 0.61: IC2.7 5.53,18.34 5.53,19.37 6.17,20 C4.1 | 7.94,19.47 7.94,9.97 9.65,8.25 JP4.2
N$46
  Bottom 0.356: R28.2 | U$13.1 21.46,51.2 R28.2 | R28.2 21.28,49.75 R33.1
N$47
  Bottom 0.61: R26.1 41.49,36.71 R34.2 41.17,36.83 41.17,35.56 C37.2
N$48  (via drill 0.9 pad 1.68)
  Bottom 0.61: CR-200.8 41.27,46.35 R25.2 41.27,48.89 v41.06,48.89
V-  (via drill 0.9 pad 1.68)
  Top 0.61: v31.75,26.04 31.75,31.11 v29.21,33.66
  Bottom 0.61: U$3.6 U$3.7 U$3.2 | U$3.3 U$3.2 | U$10.A 33.97,36.35 33.18,35.56 U$3.2 | U$3.6 28.57,34.29 v29.21,33.66 | U$2.A 31.28,25.57 v31.75,26.04 | U$3.6 24.87,34.29 C7.2